# EAGLE design Memory Display V2 (EAGLE 7.7.0)
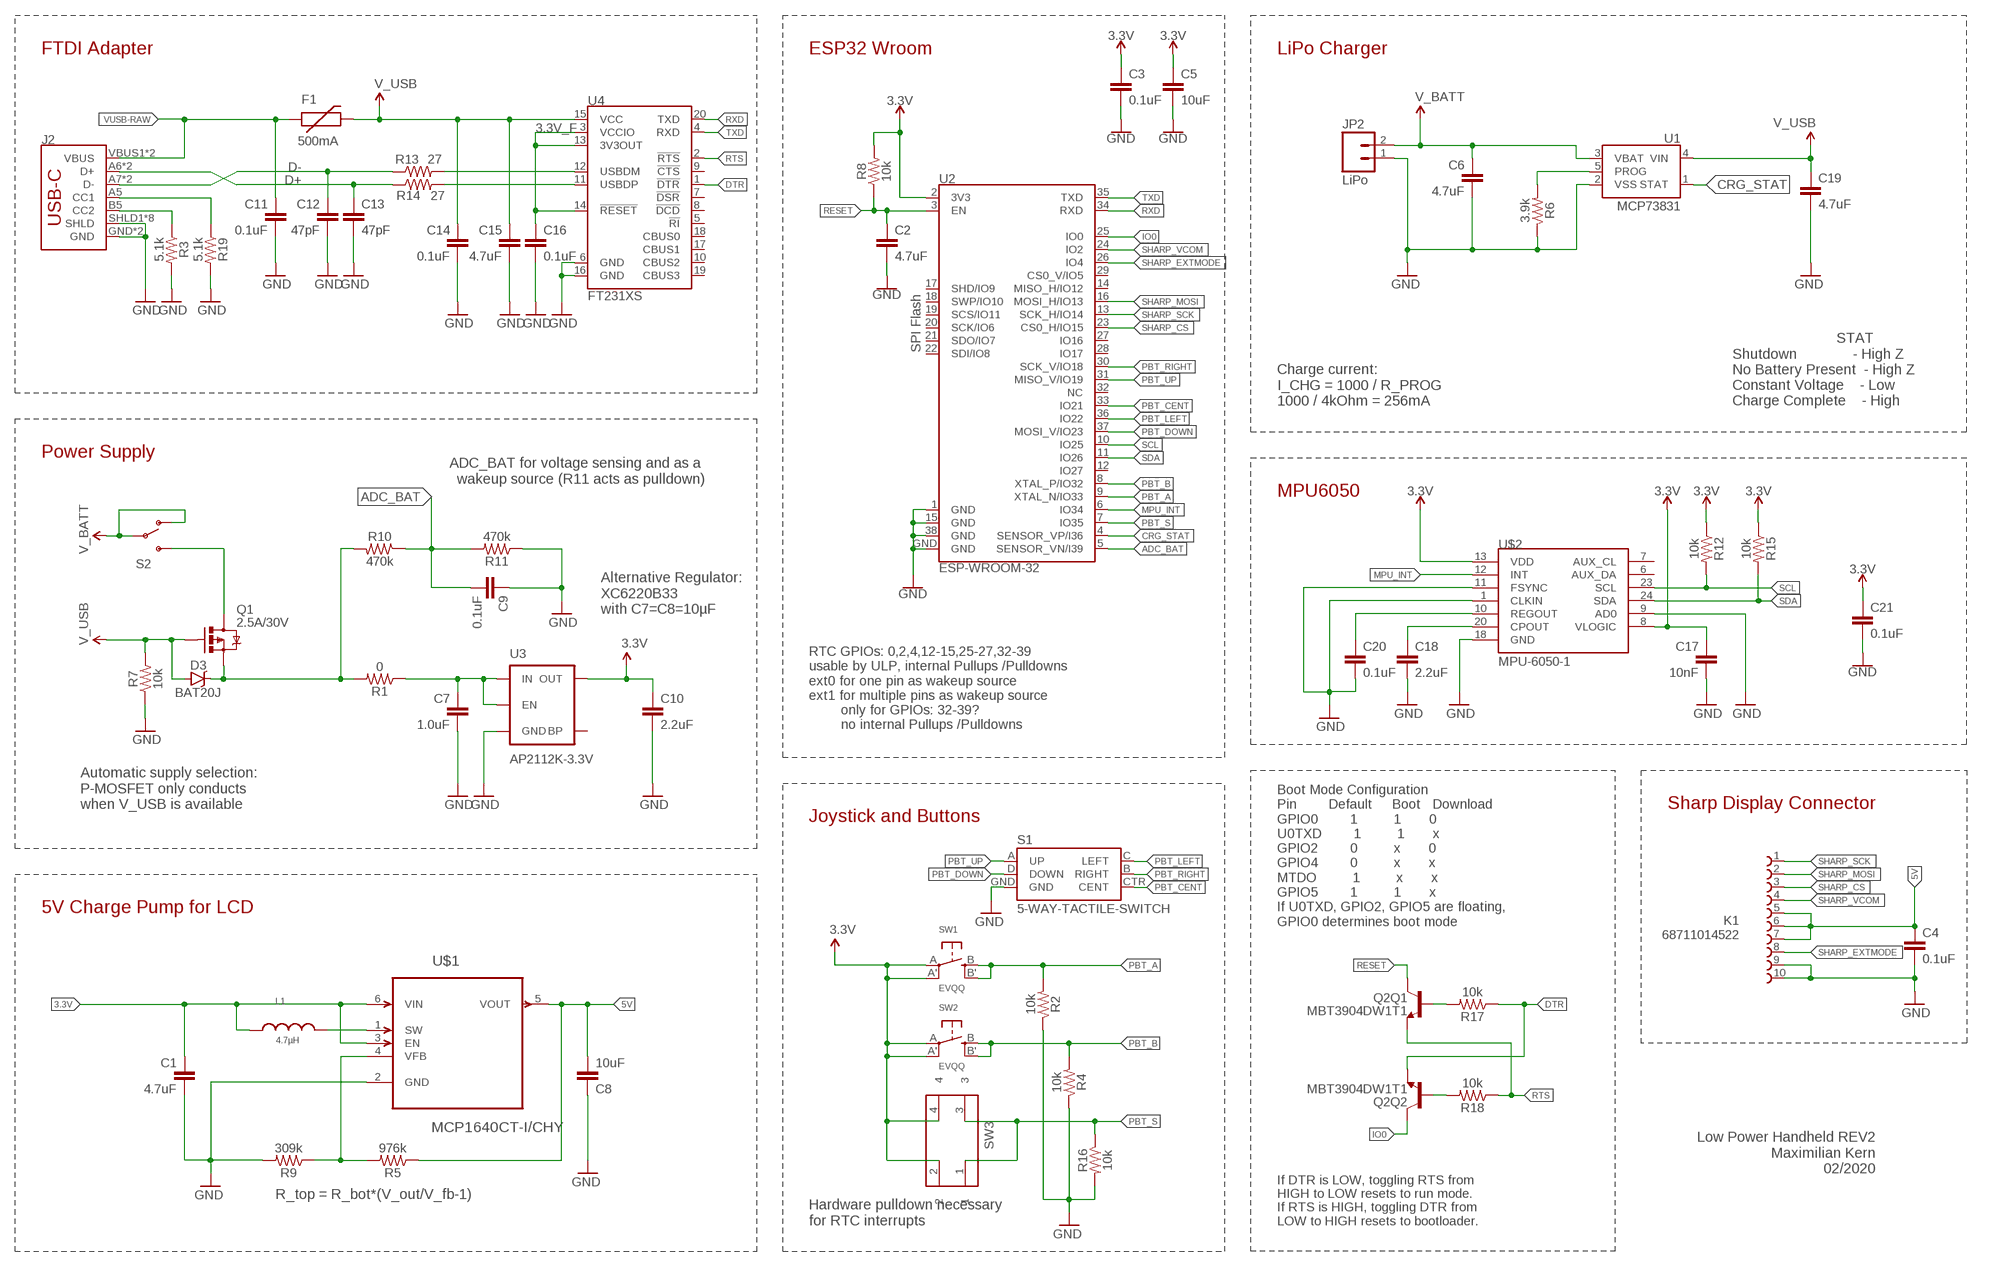
[diagram p0: schematic, sheet 1]

## Parts
C1  4.7uF  47PF-0603-50V-5%  [0603]
C2  4.7uF  0.1UF-0603-25V-(+80/-20%)  [0603]
C3  0.1uF  0.1UF-0603-25V-(+80/-20%)  [0603]
C4  0.1uF  0.1UF-0603-25V-(+80/-20%)  [0603]
C5  10uF  10UF-0603-6.3V-20%  [0603]
C6  4.7uF  4.7UF0603  [0603]
C7  1.0uF  1.0UF-0805-25V-(+80/-20%)  [0805]
C8  10uF  47PF-0603-50V-5%  [0603]
C9  0.1uF  0.1UF-0603-25V-(+80/-20%)  [0603]
C10  2.2uF  1.0UF-0805-25V-(+80/-20%)  [0805]
C11  0.1uF  0.1UF-0603-25V-(+80/-20%)  [0603]
C12  47pF  47PF-0603-50V-5%  [0603]
C13  47pF  47PF-0603-50V-5%  [0603]
C14  0.1uF  0.1UF-0603-25V-(+80/-20%)  [0603]
C15  4.7uF  4.7UF-6.3V-10%(0603)0603  [0603-CAP]
C16  0.1uF  0.1UF-0603-25V-(+80/-20%)  [0603]
C17  10nF  47PF-0603-50V-5%  [0603]
C18  2.2uF  1.0UF-0805-25V-(+80/-20%)  [0805]
C19  4.7uF  4.7UF0603  [0603]
C20  0.1uF  0.1UF-0603-25V-(+80/-20%)  [0603]
C21  0.1uF  0.1UF-0603-25V-(+80/-20%)  [0603]
D3  BAT20J  DIODE-SCHOTTKY-BAT20J  [SOD-323]
F1  500mA  PTCSMD  [PTC-1206]
J2  USB_C16PIN  [USB-C-16P]
JP2  LiPo  M02JST-PTH-2  [JST-2-PTH]
K1  68711014522  [68711014522]
L1  4.7µH  WE-TPC_2813_744029004  [WE-TPC_2811/2813_OLD]
Q1  2.5A/30V  MOSFET-PCHANNELDMG2307L  [SOT23-3]
Q2  MBT3904DW1T1  [SC70-6]
R1  0  10KOHM-0603-1/10W-1%  [0603]
R2  10k  10KOHM-0603-1/10W-1%  [0603]
R3  5.1k  10KOHM-0603-1/10W-1%  [0603]
R4  10k  10KOHM-0603-1/10W-1%  [0603]
R5  976k  10KOHM-0603-1/10W-1%  [0603]
R6  3.9k  2.0KOHM1/10W5%(0603)  [0603]
R7  10k  10KOHM-0603-1/10W-1%  [0603]
R8  10k  10KOHM-0603-1/10W-1%  [0603]
R9  309k  10KOHM-0603-1/10W-1%  [0603]
R10  470k  10KOHM-0603-1/10W-1%  [0603]
R11  470k  10KOHM-0603-1/10W-1%  [0603]
R12  10k  10KOHM-0603-1/10W-1%  [0603]
R13  27  27OHM1/10W1%(0603)0603-RES  [0603]
R14  27  27OHM1/10W1%(0603)0603-RES  [0603]
R15  10k  10KOHM-0603-1/10W-1%  [0603]
R16  10k  10KOHM-0603-1/10W-1%  [0603]
R17  10k  10KOHM-0603-1/10W-1%  [0603]
R18  10k  10KOHM-0603-1/10W-1%  [0603]
R19  5.1k  10KOHM-0603-1/10W-1%  [0603]
S1  5-WAY-TACTILE-SWITCH  JOYSTICK_MINI  [JOYSTICK_MINI]
S2  SWITCH-SPDT-SMD-A  [SWITCH-SPST-SMD-A]
SW1  EVQQ  SWITCH_TACT_SMT_EVQQ2_SMALL  [EVQ-Q2_SMALLER]
SW2  EVQQ  SWITCH_TACT_SMT_EVQQ2_SMALL  [EVQ-Q2_SMALLER]
SW3  434331045822  [434331045822]
U1  MCP73831  [SOT23-5]
U2  ESP-WROOM-32  [ESP-WROOM-32]
U3  AP2112K-3.3V  V_REG_LDOSMD  [SOT23-5]
U4  FT231XS  [SSOP20_L]
U$1  MCP1640CT-I/CHY  [SOT95P270X145-6N]
U$2  MPU-6050-1  [QFN-24-4MM2]

## Nets
3.3V: C1.1 C3.1 C5.1 C10.1 C17.1 C21.1 L1.1 R8.2 R12.1 R15.1 SW1.A'(P1) SW1.A(P) SW2.A'(P1) SW2.A(P) SW3.2 SW3.4 U2.2(3V3) U3.5(OUT) U$1.3(EN) U$1.6(VIN) U$2.8(VLOGIC) U$2.13(VDD)
3.3V_F: C16.1 U4.3(VCCIO) U4.13(3V3OUT) U4.14(!RESET)
5V: C4.1 C8.2 K1.5 K1.6 K1.7 R5.1 U$1.5(VOUT)
ADC_BAT: C9.2 R10.1 R11.2 U2.5(SENSOR_VN/I39)
B_VFB: R5.2 R9.1 U$1.4(VFB)
CRG_STAT: U1.1(STAT) U2.4(SENSOR_VP/I36)
D+: C13.1 J2.A6(D+) J2.B6(D+) R14.1
D-: C12.1 J2.A7(D-) J2.B7(D-) R13.1
DTR: Q2.1(Q2:E) R17.1 U4.1(!DTR)
GND: C1.2 C2.2 C3.2 C4.2 C5.2 C6.2 C7.2 C8.1 C9.1 C10.2 C11.2 C12.2 C13.2 C14.2 C15.2 C16.2 C17.2 C18.2 C19.2 C20.2 C21.2 J2.GND J2.GND2(GND) J2.SHLD1(SHLD) J2.SHLD2(SHLD) J2.SHLD3(SHLD) J2.SHLD4(SHLD) J2.SHLD5(SHLD) J2.SHLD6(SHLD) J2.SHLD7(SHLD) J2.SHLD8(SHLD) JP2.1 K1.9 K1.10 R2.1 R3.2 R4.1 R6.1 R7.1 R9.2 R11.1 R16.2 R19.2 S1.GND U1.2(VSS) U2.1(GND) U2.15(GND) U2.38(GND) U2.GND U3.2(GND) U4.6(GND) U4.16(GND) U$1.2(GND) U$2.1(CLKIN) U$2.9(AD0) U$2.11(FSYNC) U$2.18(GND)
IO0: Q2.6(Q2:C) U2.25(IO0)
MPU_INT: U2.6(IO34) U$2.12(INT)
N$2: L1.2 U$1.1(SW)
N$3: C7.1 R1.1 U3.1(IN) U3.3(EN)
N$4: Q1.3(D) S2.3(S)
N$5: D3.C Q1.2(S) R1.2 R10.2
N$7: R13.2 U4.12(USBDM)
N$8: R14.2 U4.11(USBDP)
N$9: J2.A5(CC1) R19.1
N$10: Q2.5(Q1:B) R17.2
N$11: J2.B5(CC2) R3.1
N$12: Q2.2(Q2:B) R18.2
N$16: R6.2 U1.5(PROG)
N$17: C18.1 U$2.20(CPOUT)
N$18: C20.1 U$2.10(REGOUT)
PBT_A: R2.2 SW1.B'(S1) SW1.B(S) U2.9(XTAL_N/IO33)
PBT_B: R4.2 SW2.B'(S1) SW2.B(S) U2.8(XTAL_P/IO32)
PBT_CENT: S1.CTR(CENT) U2.33(IO21)
PBT_DOWN: S1.D(DOWN) U2.37(MOSI_V/IO23)
PBT_LEFT: S1.C(LEFT) U2.36(IO22)
PBT_RIGHT: S1.B(RIGHT) U2.30(SCK_V/IO18)
PBT_S: R16.1 SW3.1 SW3.3 U2.7(IO35)
PBT_UP: S1.A(UP) U2.31(MISO_V/IO19)
RESET: C2.1 Q2.3(Q1:C) R8.1 U2.3(EN)
RTS: Q2.4(Q1:E) R18.1 U4.2(!RTS)
RXD: U2.34(RXD) U4.20(TXD)
SCL: R12.2 U2.10(IO25) U$2.23(SCL)
SDA: R15.2 U2.11(IO26) U$2.24(SDA)
SHARP_CS: K1.3 U2.23(CS0_H/IO15)
SHARP_EXTMODE: K1.8 U2.26(IO4)
SHARP_MOSI: K1.2 U2.16(MOSI_H/IO13)
SHARP_SCK: K1.1 U2.13(SCK_H/IO14)
SHARP_VCOM: K1.4 U2.24(IO2)
TXD: U2.35(TXD) U4.4(RXD)
V_BATT: C6.1 JP2.2 S2.1(O) S2.2(P) U1.3(VBAT)
V_USB: C14.1 C15.1 C19.1 D3.A F1.2 Q1.1(G) R7.2 U1.4(VIN) U4.15(VCC)
VUSB-RAW: C11.1 F1.1 J2.VBUS1(VBUS) J2.VBUS2(VBUS)
Unconnected: U2.12(IO27) U2.14(MISO_H/IO12) U2.17(SHD/IO9) U2.18(SWP/IO10) U2.19(SCS/IO11) U2.20(SCK/IO6) U2.21(SDO/IO7) U2.22(SDI/IO8) U2.27(IO16) U2.28(IO17) U2.29(CS0_V/IO5) U2.32(NC) U3.4(BP) U4.5(!RI) U4.7(!DSR) U4.8(!DCD) U4.9(!CTS) U4.10(CBUS2) U4.17(CBUS1) U4.18(CBUS0) U4.19(CBUS3) U$2.6(AUX_DA) U$2.7(AUX_CL)

## Notes on the sheet
- FTDI Adapter | ESP32 Wroom | LiPo Charger
- SPI Flash
- Charge current:
  I_CHG = 1000 / R_PROG
  1000 / 4kOhm = 256mA
- STAT
  Shutdown              - High Z 
  No Battery Present  - High Z 
  Constant Voltage    - Low
  Charge Complete    - High
- Power Supply
- ADC_BAT for voltage sensing and as a 
  wakeup source (R11 acts as pulldown)
- MPU6050
- Alternative Regulator: 
  XC6220B33
  with C7=C8=10µF
- RTC GPIOs: 0,2,4,12-15,25-27,32-39
  usable by ULP, internal Pullups /Pulldowns
  ext0 for one pin as wakeup source
  ext1 for multiple pins as wakeup source
          only for GPIOs: 32-39?
          no internal Pullups /Pulldowns
- Sharp Display Connector
- Automatic supply selection:
  P-MOSFET only conducts
  when V_USB is available
- Joystick and Buttons
- 5V Charge Pump for LCD
- Boot Mode Configuration
  Pin        Default     Boot   Download
  GPIO0        1         1       0
  U0TXD        1         1       x
  GPIO2        0         x       0
  GPIO4        0         x       x
  MTDO         1         x       x
  GPIO5        1         1       x
  If U0TXD, GPIO2, GPIO5 are floating, 
  GPIO0 determines boot mode
- Low Power Handheld REV2
  Maximilian Kern
  02/2020
- R_top = R_bot*(V_out/V_fb-1)
- Hardware pulldown necessary
  for RTC interrupts
- If DTR is LOW, toggling RTS from 
  HIGH to LOW resets to run mode.
  If RTS is HIGH, toggling DTR from 
  LOW to HIGH resets to bootloader.

## Library data of the parts
C1 C8 C17 = SparkFun-Capacitors:47PF: 47pF ceramic capacitors A capacitor is a passive two-terminal electrical component used to store electrical energy temporarily in an electric field.; PROD_ID: CAP-08913; VALUE: 47pF
C2 = SparkFun-Capacitors:0.1UF: 0.1µF ceramic capacitors A capacitor is a passive two-terminal electrical component used to store electrical energy temporarily in an electric field.; PROD_ID: CAP-00810; VALUE: 0.1uF
C3 C4 C9 C11 C14 C16 C20 C21 = SparkFun-Capacitors:0.1UF: 0.1µF ceramic capacitors A capacitor is a passive two-terminal electrical component used to store electrical energy temporarily in an electric field.; PROD_ID: CAP-00810
C5 = SparkFun-Capacitors:10UF: 10.0µF ceramic capacitors A capacitor is a passive two-terminal electrical component used to store electrical energy temporarily in an electric field.; PROD_ID: CAP-11015
C6 C19 = SparkFun-Capacitors:4.7UF: 4.7µF ceramic capacitors A capacitor is a passive two-terminal electrical component used to store electrical energy temporarily in an electric field.; PROD_ID: CAP-08280
C7 = SparkFun-Capacitors:1.0UF: 1µF ceramic capacitors A capacitor is a passive two-terminal electrical component used to store electrical energy temporarily in an electric field.; PROD_ID: CAP-11625
C10 C18 = SparkFun-Capacitors:1.0UF: 1µF ceramic capacitors A capacitor is a passive two-terminal electrical component used to store electrical energy temporarily in an electric field.; PROD_ID: CAP-11625; VALUE: 1.0uF
C12 C13 = SparkFun-Capacitors:47PF: 47pF ceramic capacitors A capacitor is a passive two-terminal electrical component used to store electrical energy temporarily in an electric field.; PROD_ID: CAP-08913
C15 = SparkFun-Capacitors:4.7UF-6.3V-10%(0603): CAP-08280; PROD_ID: CAP-08280
D3 = SparkFun-DiscreteSemi:DIODE-SCHOTTKY: Schottky diodes in SFE's production catalog BAT20J 1A 23V 0.62Vf RB751 120mA 40V 0.37Vf PMEG4005EJ 0.5A 40V 0.42Vf MBRA140 1A 40V 0.5Vf B340A 3A 40V SMA; PROD_ID: DIO-11623
F1 = SparkFun-PowerIC:PTC: Resettable Fuse PTC Resettable Fuse. Spark Fun Electronics SKU : COM-08357; PROD_ID: RES-11150
J2 = SparkFun-Connectors:USB_C: USB Type C 16Pin Connector Super Speed pins not available on the 16-pin purely SMD connector so this part is best for USB 2.0 implementations. D1 and D2 are tied together enabling D+/- no matter which way the cable is plugged into the connector. The two channel configuration pins (CC1/2) are exposed. These are normally connected to ground via 5.1k resistors but can be reconfigured for high current/high power applications.; PROD_ID: CONN-14122
JP2 = SparkFun-Connectors:M02: Standard 2-pin 0.1" header. Use with - straight break away headers ( PRT-00116) - right angle break away headers (PRT-00553) - swiss pins (PRT-00743) - machine pins (PRT-00117) - female headers (PRT-00115) Molex polarized connector foot print use with: PRT-08233 with associated crimp pins and housings. 2.54_SCREWTERM for use with PRT-10571. 3.5mm Screw Terminal footprints for PRT-08084 5mm Screw Terminal footprints for use with PRT-08432; PROD_ID: CONN-09863; SKU: PRT-09914
K1 = Eagle_FPC_CONNECTOR_AND_FFC_CAB_rev15c:68711014522: WR-FPC 0.5mm SMT ZIF Horizontal Bottom Contact, 10 Pins=>Code : Con_FPC_ZIF_0.50_68711014522 <http://katalog.we-online.de/media/images/eican/Con_FPC_ZIF_0.50_6871xx14522_pf2.jpg> Details see: http://katalog.we-online.de/en/em/687_1xx_145_22 Created 2014-07-09, Karrer Zheng 2014 (C) Würth Elektronik
L1 = EMCComponents (rev19e):WE-TPC_2813: SMD Shielded Tiny Power Inductor Characteristics Extremely flat power inductor High current capability Magnetically shielded which results in a low leakage field Operating temperature: –40 °C to +125 °C Applications Portable power like PDA, digital camera, PCMCIA cards and displays DC/DC converter Embedded PC Mobile data gathering, telemetric <http://katalog.we-online.de/media/images/v2/WE-TPC_Gruppe_2.jpg> Details see: http://katalog.we-online.de/en/pbs/WE-TPC? Updated by Dan Xu 2014-07-11 2014 (C) Wurth Elektronik; WE-NUMBER: 744029004/4,7uH
Q1 = SparkFun-DiscreteSemi:MOSFET-PCHANNEL: Generic PMOSFET IRLML2244 - TRANS-11153 (SOT-23 -20V -4.3A) (1.Gate 2.Source 3.Drain) FQP27P06 - COM-10349 <http://www.sparkfun.com/products/10349> (TO-220 -60V -27A) (1.Gate 2.Source 3.Drain); PROD_ID: TRANS-11308
Q2 = esp32-thing-temp:MBT3904DW1T1: MBT3904DW1 Dual NPN Transistors The MBT3904W1 puts two general purpose 3904 NPN transistors in a single package. Datasheet <http://www.onsemi.com/pub_link/Collateral/MBT3904DW1T1-D.PDF>; PROD_ID: TRANS-13337
R1 R3 R5 R9-R11 R19 = SparkFun-Resistors:10KOHM: 10kΩ resistor A resistor is a passive two-terminal electrical component that implements electrical resistance as a circuit element. Resistors act to reduce current flow, and, at the same time, act to lower voltage levels within circuits. - Wikipedia; PROD_ID: RES-00824; VALUE: 10k
R2 R4 R7 R8 R12 R15-R18 = SparkFun-Resistors:10KOHM: 10kΩ resistor A resistor is a passive two-terminal electrical component that implements electrical resistance as a circuit element. Resistors act to reduce current flow, and, at the same time, act to lower voltage levels within circuits. - Wikipedia; PROD_ID: RES-00824
R6 = SparkFun-Resistors:2.0KOHM1/10W5%(0603): RES-08296; PROD_ID: RES-08296; VALUE: 2.0k
R13 R14 = SparkFun-Resistors:27OHM1/10W1%(0603): RES-09334; PROD_ID: RES-09334
S1 = SparkFun-Electromechanical:JOYSTICK_MINI: Small 5-way tactile joystick, COM-10063 4UCON SF303GJ26
S2 = SparkFun-Electromechanical:SWITCH-SPDT: SPDT Switch Simple slide switch, Spark Fun Electronics SKU : COM-00102 DPDT SMT slide switch, AYZ0202, SWCH-08179; PROD_ID: SWCH-10651
SW1 SW2 = microbuilder:SWITCH_TACT_SMT: SMT Tact Switches 6x6mm - Digikey: P12940SCT-ND KMR2 (4.6x2.8mm) - Digikey: 401-1426-1-ND EVQ-PQHB55 - Light Touch, 160GF (4.5x4.5mm) - Digikey: P8090SCT-ND KMT0 - KMT021 NGJ LHS (etc.) IP68/Waterproof - Digikey: CKN10289CT-ND
SW3 = Eagle_TACT_SWITCHES_rev16d:434331045822: 3.5x4.7 mm SMD side push WS-TASU <http://katalog.we-online.de/media/images/v2/Family_WS_TUS_Normal_SMD_Side-Push_4343x10458xx_pf2.jpg> Details see: http://katalog.we-online.de/en/em/TASU_3_5X4_7_SMD_J-BEND_SIDE_PUSH <http://katalog.we-online.de/en/em/TASU_3_5X4_7_SMD_SIDE_PUSH> 2015 (C) Wurth Elektronik
U1 = SparkFun-PowerIC:MCP73831: Miniature single cell, fully integrated Li-Ion, Li-polymer charge management controller http://ww1.microchip.com/downloads/en/DeviceDoc/20001984g.pdf IC-09995; PROD_ID: IC-09995
U2 = SparkFun-RF:ESP-WROOM-32; PROD_ID: IC-13849
U3 = SparkFun-PowerIC:V_REG_LDO: Voltage Regulator LDO Standard 150mA LDO voltage regulator in SOT-23 layout. Micrel part MIC5205. BP (by-pass) pin is used to lower output noise with 470pF cap.; PROD_ID: VREG-12457
U4 = SparkFun-DigitalIC:FT231X: FTDI FT231X Full Speed USB to Full-handshake UART This USB2.0 Full Speed IC offers a compact bridge to full handshake UART interfaces. The device is a UART, capable of operating up to 3MBaud, with low power consumption (8mA). The FT231X includes the complete FT-X series feature set and enables USB to be added into a system design quickly and easily over a UART interface.; PROD_ID: IC-11524
U$1 = Microchip_By_element14_Batch_1:MCP1640CT-I/CHY: Synchronous Boost Regulator; MPN: MCP1640CT-I/CHY; OC_FARNELL: 1800208; OC_NEWARK: 73R3626; PACKAGE: SOT-6; SUPPLIER: Microchip
U$2 = MPU-6050 hand solder:MPU-6050

## Board
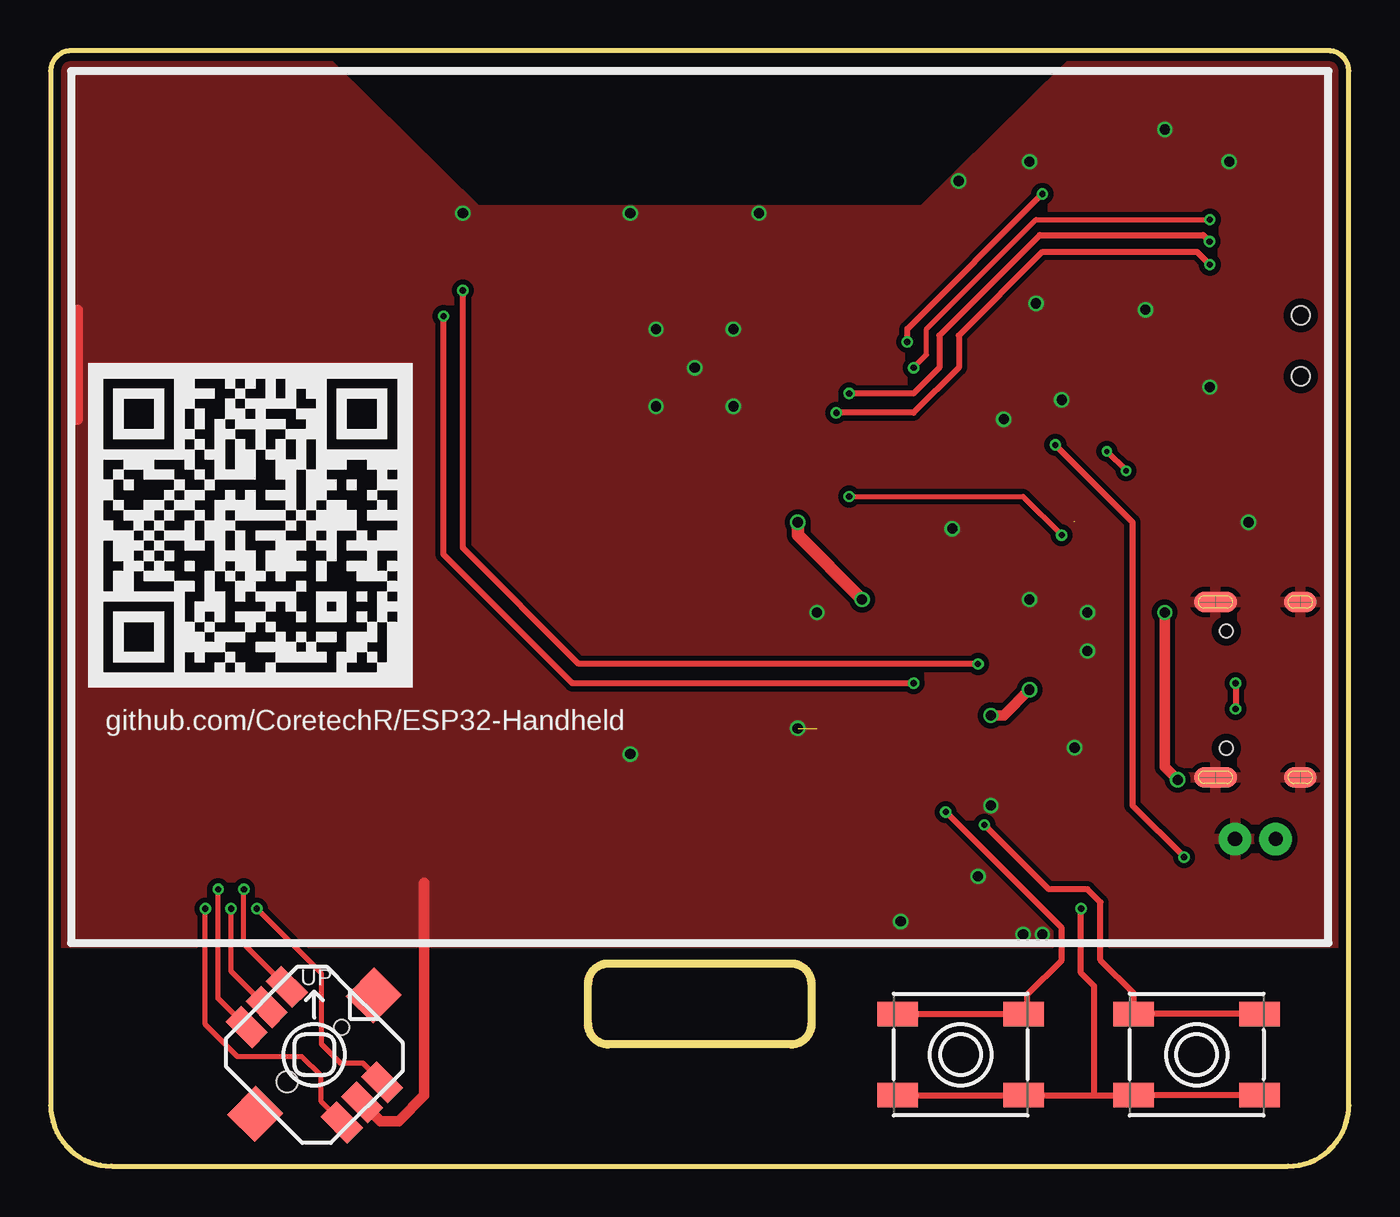
[diagram p1: board, top side]
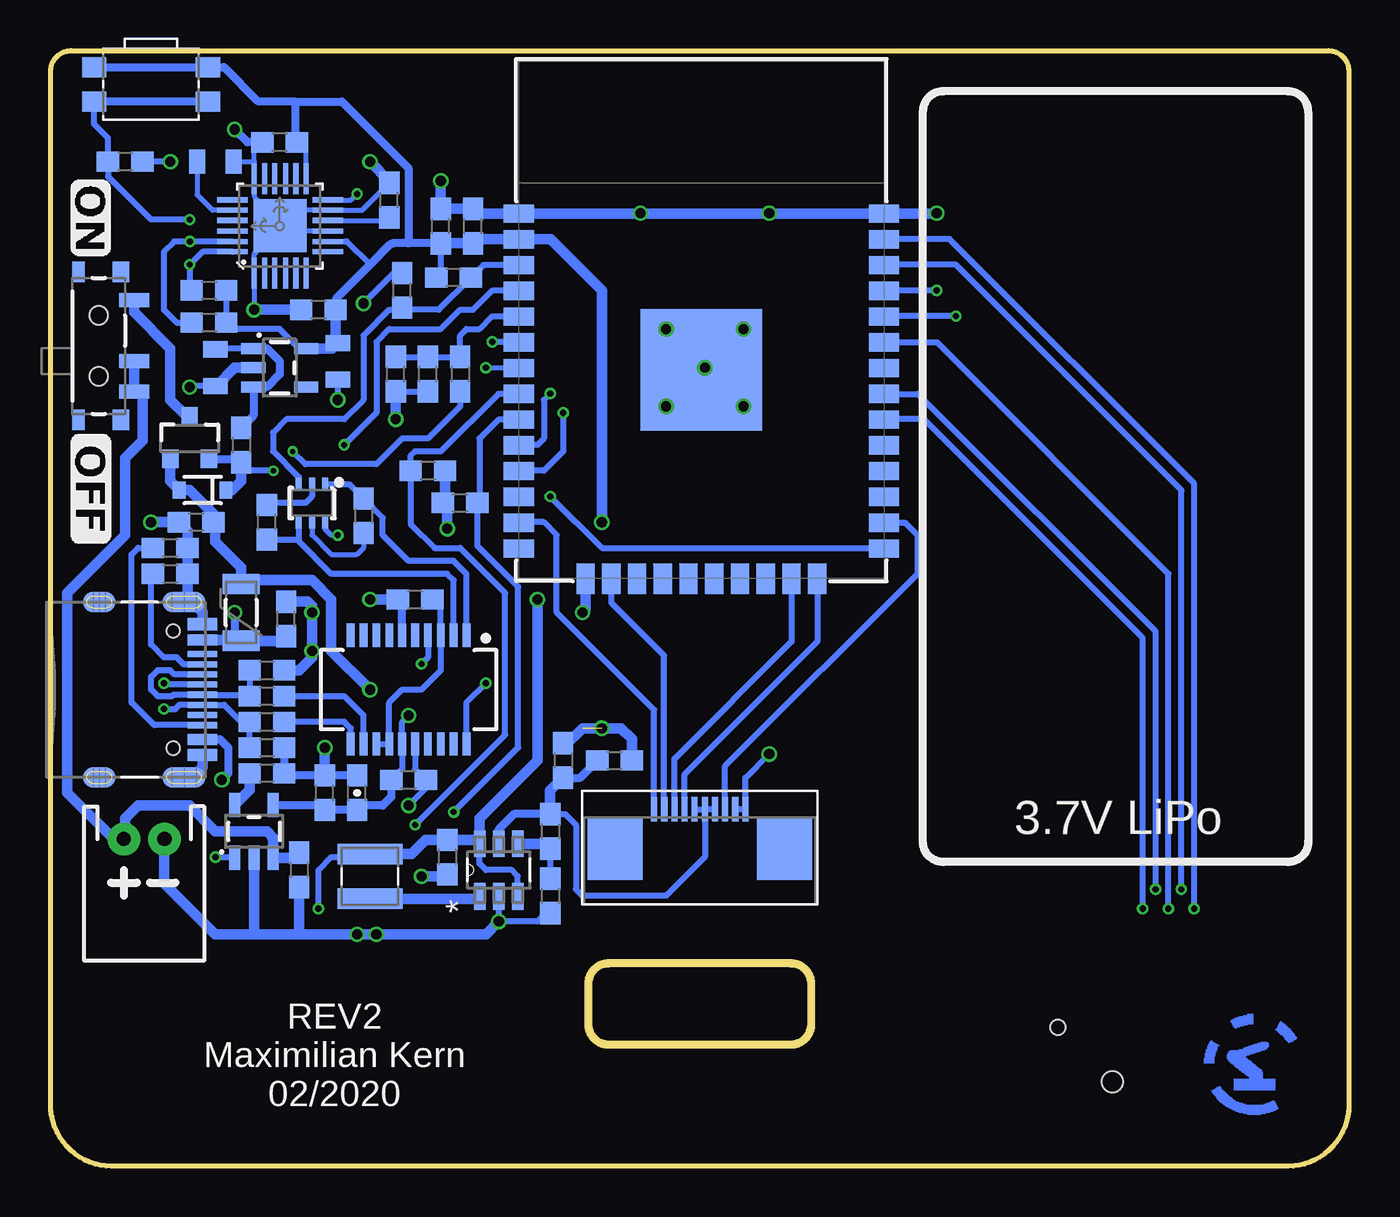
[diagram p2: board, bottom side, seen from below]

Size 64 x 55 mm. Coordinates in mm from the lower left corner, seen from the top.
Outline: 63,55 1,55 arc90 0,54 0,3 arc90 3,0 61,0 arc90 64,3 64,54 arc90 63,55
Copper layers (1*16): Top 0.035559375mm / dielectric 1.6mm / Bottom 0.035559375mm
Design rules "oshpark-2layer *": minimum track width 6mil, minimum drill 10mil, track to track 6mil, track to pad 6mil, pad to pad 6mil, via to via 6mil, smd to smd 6mil, copper to edge 15mil, drill to drill 6mil, minimum pad ring 5mil, minimum via ring 5mil, stop-mask expansion 2.5mil, vias tented up to drill 43mil, thermal gap 10mil
bKeepout: area 2,15 to 21,53
Milling: 8 lines

### Footprints (pad centres in the part's own frame; a part is rotated, then mirrored left to right if it is on the bottom)
0603 = smd 1.1 x 1: 1 -0.85,0; 2 0.85,0
0805 = smd 0.8 x 1.2: 1 -0.9,0; 2 0.9,0
0603-CAP = smd 1.1 x 1: 1 -0.85,0; 2 0.85,0
SOD-323 = smd 0.63 x 0.83: A 1.15,0; C -1.15,0
PTC-1206 = smd 1 x 1.8: 1 -1.4,0; 2 1.4,0
USB-C-16P = smd 0.3 x 1.45: A5 -1.25,0; A6 -0.25,0; A7 0.25,0; A8 1.25,0; B5 1.75,0; B6 0.75,0; B7 -0.75,0; B8 -1.75,0 | smd 0.6 x 1.45: GND -3.225,0; GND2 3.225,0 | smd 1 x 2.1: SHLD1 -4.32,-0.915; SHLD2 4.32,-0.915 | smd 1 x 2.1 bottom: SHLD3 -4.32,-0.915; SHLD4 4.32,-0.915 | smd 1 x 1.6: SHLD5 -4.32,-5.095; SHLD8 4.32,-5.095 | smd 1 x 1.6 bottom: SHLD6 -4.32,-5.095; SHLD7 4.32,-5.095 | smd 0.55 x 1.45: VBUS1 -2.45,0; VBUS2 2.45,0 | hole 0.65: -2.89,-1.445; 2.89,-1.445
JST-2-PTH = drill 0.7 pad 1.6: 1 -1,0; 2 1,0
68711014522 = smd 0.3 x 1.2: 1 -2.25,0.6; 2 -1.75,0.6; 3 -1.25,0.6; 4 -0.75,0.6; 5 -0.25,0.6; 6 0.25,0.6; 7 0.75,0.6; 8 1.25,0.6; 9 1.75,0.6; 10 2.25,0.6 | smd 2.7 x 3: Z1 -4.18,-1.38; Z2 4.18,-1.38
WE-TPC_2811/2813_OLD = smd 1 x 3.2: 1 -1.1,0; 2 1.1,0
SOT23-3 = smd 0.8 x 0.9: 1 -0.95,-1; 2 0.95,-1; 3 0,1.1
SC70-6 = smd 0.3 x 0.66: 1 -0.65,-0.92; 2 0,-0.92; 3 0.65,-0.92; 4 0.65,0.92; 5 0,0.92; 6 -0.65,0.92
JOYSTICK_MINI = smd 1.85 x 1.1: A -3.325,1.4; B 3.325,1.4; C -3.325,-1.4; CTR -3.325,0; D 3.325,-1.4; GND 3.325,0 | smd 1.9 x 2: NC 0,4.13; NC@0 0,-4.13 | hole 0.75: 0,1.9 | hole 1.05: 0,-1.9
SWITCH-SPST-SMD-A = smd 0.7 x 1.5: 1 -2.25,-1.75; 2 -0.75,-1.75; 3 2.25,-1.75 | smd 1 x 0.6: GND1 -3.65,1; GND3 3.65,1 | smd 1 x 0.8: GND2 -3.65,-1.1; GND4 3.65,-1.1 | hole 0.9: -1.5,0; 1.5,0
EVQ-Q2_SMALLER = smd 2 x 1.2: A -3.1,-2; A' 3.1,-2; B -3.1,2; B' 3.1,2
434331045822 = smd 1.2 x 1: 1 2.8,0.85; 2 2.8,-0.85; 3 -2.8,0.85; 4 -2.8,-0.85
SOT23-5 = smd 0.55 x 1.2: 1 -0.95,-1.3; 2 0,-1.3; 3 0.95,-1.3; 4 0.95,1.3; 5 -0.95,1.3
ESP-WROOM-32 = smd 0.9 x 1.5: 1 7.7,9; 2 6.43,9; 3 5.16,9; 4 3.89,9; 5 2.62,9; 6 1.35,9; 7 0.08,9; 8 -1.19,9; 9 -2.46,9; 10 -3.73,9; 11 -5,9; 12 -6.27,9; 13 -7.54,9; 14 -8.81,9; 25 -8.81,-9; 26 -7.54,-9; 27 -6.27,-9; 28 -5,-9; 29 -3.73,-9; 30 -2.46,-9; 31 -1.19,-9; 32 0.08,-9; 33 1.35,-9; 34 2.62,-9; 35 3.89,-9; 36 5.16,-9; 37 6.43,-9; 38 7.7,-9 | smd 1.5 x 0.9: 15 -10.3,5.715; 16 -10.3,4.445; 17 -10.3,3.175; 18 -10.3,1.905; 19 -10.3,0.635; 20 -10.3,-0.635; 21 -10.3,-1.905; 22 -10.3,-3.175; 23 -10.3,-4.445; 24 -10.3,-5.715 | smd 6 x 6: GND 0,0
SSOP20_L = smd 0.381 x 1.143: 1 -2.857,-2.68; 2 -2.223,-2.68; 3 -1.587,-2.68; 4 -0.953,-2.68; 5 -0.318,-2.68; 6 0.318,-2.68; 7 0.953,-2.68; 8 1.587,-2.68; 9 2.223,-2.68; 10 2.857,-2.68; 11 2.857,2.68; 12 2.223,2.68; 13 1.587,2.68; 14 0.953,2.68; 15 0.318,2.68; 16 -0.318,2.68; 17 -0.953,2.68; 18 -1.587,2.68; 19 -2.223,2.68; 20 -2.857,2.68
SOT95P270X145-6N = smd 1.321 x 0.559: 1 -1.295,0.94; 2 -1.295,0; 3 -1.295,-0.94; 4 1.295,-0.94; 5 1.295,0; 6 1.295,0.94
QFN-24-4MM2 = smd 1.516 x 0.254: 1 -2.316,1.257; 2 -2.316,0.75; 3 -2.316,0.247; 4 -2.316,-0.287; 5 -2.316,-0.792; 6 -2.316,-1.297; 13 2.336,-1.297; 14 2.336,-0.792; 15 2.336,-0.287; 16 2.336,0.247; 17 2.336,0.75; 18 2.336,1.257 | smd 0.254 x 1.516: 7 -1.267,-2.372; 8 -0.762,-2.372; 9 -0.258,-2.372; 10 0.278,-2.372; 11 0.78,-2.372; 12 1.287,-2.372; 19 1.287,2.332; 20 0.78,2.332; 21 0.278,2.332; 22 -0.258,2.332; 23 -0.762,2.332; 24 -1.267,2.332 | smd 2.616 x 2.616: P$1 0.02,-0.01

### Placement (x,y rotation side)
C1  44.45,15.24 270 bottom
C2  46.67,43.18 90 bottom
C3  44.77,46.35 90 bottom
C4  36.2,20 0 bottom
C5  43.18,46.35 90 bottom
C6  51.75,14.61 270 bottom
C7  55.88,39.37 270 bottom
C8  38.73,20 270 bottom
C9  46.99,39.05 90 bottom
C10  49.85,39.69 270 bottom
C11  52.39,26.99 90 bottom
C12  53.34,24.45 0 bottom
C13  53.34,20.64 0 bottom
C14  46.35,19.05 0 bottom
C15  48.9,18.41 90 bottom
C16  46.04,27.94 180 bottom
C17  50.8,42.23 180 bottom
C18  55.88,49.53 0 bottom
C19  50.48,18.41 90 bottom
C20  47.31,47.62 90 bottom
C21  52.7,50.48 180 bottom
D3  56.52,33.34 180 bottom
F1  54.61,27.3 90 bottom
J2  56.52,23.5 270 bottom
JP2  59.4,16.14 180 bottom
K1  32,17 0 bottom
L1  48.26,14.29 270 bottom
Q1  57.15,35.88 0 bottom
Q2  51.12,32.7 180 bottom
R1  54.61,35.56 270 bottom
R2  43.81,32.7 0 bottom
R3  58.1,30.48 0 bottom
R4  45.4,34.29 180 bottom
R5  39.37,16.51 270 bottom
R6  53.34,19.37 180 bottom
R7  56.83,31.75 0 bottom
R8  44.13,43.81 180 bottom
R9  39.37,13.34 270 bottom
R10  43.81,39.05 270 bottom
R11  45.4,39.05 90 bottom
R12  56.2,41.59 180 bottom
R13  53.34,23.18 0 bottom
R14  53.34,21.91 0 bottom
R15  56.2,43.18 180 bottom
R16  60.33,49.53 0 bottom
R17  48.58,32.07 270 bottom
R18  53.34,31.75 90 bottom
R19  58.1,29.21 0 bottom
S1  13,5.5 315 top
S2  61.63,40.45 90 bottom
SW1  44.87,5.5 0 top
SW2  56.5,5.5 0 top
SW3  59.05,53.34 180 bottom
U1  53.98,16.51 0 bottom
U2  31.92,39.27 90 bottom
U3  52.7,39.37 270 bottom
U4  46.35,23.5 180 bottom
U$1  41.91,14.61 90 bottom
U$2  52.7,46.35 90 bottom

### Tracks (layer width: path | path; a pad name or v marks a point on that pad's centre or on a via)
3.3V  (via drill 0.3, 0.5)
  Top 0.305: SW1.A SW1.A' 51.44,3.5 | SW2.A' SW2.A 51.44,3.5 | v50.8,12.7 50.8,9.53 51.44,8.89 51.44,3.5
  Top 0.61: v36.83,31.75 36.83,31.11 v40.01,27.94
  Bottom 0.254: U$2.8 49.51,45.59 | U$2.13 51.41,50.04 C21.1
  Bottom 0.305: 49.51,45.59 49.4,45.59 48.26,44.45 | U$1.3 40.97,14.3 41.27,14.61 42.55,14.61 42.86,14.92 42.86,15.89 U$1.6 | R15.1 R12.1 | v50.8,12.7 50.8,14.61 50.16,15.24 48.41,15.24 L1.1 | 55.13,41.37 R12.1 | C3.1 44.77,44.03 R8.2 | U3.5 51.75,40.32 52.7,41.27 55.03,41.27 R12.1
  Bottom 0.406: 46.35,45.51 47.1,45.51 arc-45 47.28,45.43 48.26,44.45 49.88,42.83 arc-45 49.95,42.66 C17.1 | 46.35,45.51 46.35,49.21 49.63,52.49 51.95,52.49 | 51.95,52.49 51.95,50.58 C21.1 | C3.1 46.35,45.51 | 51.95,52.49 53.76,52.49 55.46,54.19 SW3.4 SW3.2
  Bottom 0.508: C3.1 C5.1 42.98,45.7 U2.2 39.35,45.7 36.83,43.18 v36.83,31.75 | v40.01,27.94 40.01,20 42.85,17.16 U$1.6 43.04,16.09 C1.1 45.51,16.09 46.21,15.39 L1.1 | C17.1 49.95,40.69 C10.1 50.12,40.32 U3.5
3.3V_F
  Bottom 0.305: U4.13 U4.14 47.31,22.86 46.67,23.5 45.72,23.5 44.77,24.45 U4.3 44.77,27.52 C16.1
5V
  Bottom 0.305: K1.7 K1.6 | K1.5 K1.6 | K1.6 31.75,15.24 33.66,13.34 37.78,13.34 38.1,13.65 38.1,16.83 38.63,17.36 R5.1
  Bottom 0.406: U$1.5 41.91,16.61 41.16,17.36 R5.1 | C8.2 37.9,19.15 C4.1
  Bottom 0.508: R5.1 39.37,18.52 C8.2
ADC_BAT
  Bottom 0.305: C9.2 R11.2 R10.1 43.81,40.96 43.5,41.27 42.86,41.27 42.23,41.91 40.94,41.91 U2.5
B_VFB
  Bottom 0.305: R5.2 R9.1
  Bottom 0.508: U$1.4 39.61,15.9 R5.2
CRG_STAT  (via drill 0.3)
  Top 0.305: v49.53,35.56 53.34,31.75 53.34,17.78 v55.88,15.24
  Bottom 0.305: U2.4 42.25,43.16 43.18,42.23 43.81,42.23 44.77,41.27 47.31,41.27 47.94,40.64 47.94,37.15 v49.53,35.56 | v55.88,15.24 54.95,15.24 U1.1
D+  (via drill 0.3)
  Top 0.305: v58.42,23.81 v58.42,22.54
  Bottom 0.305: C13.1 R14.1 54.61,21.91 55.45,22.75 J2.B6 57.66,22.75 57.86,22.54 v58.42,22.54 | J2.A6 58.35,23.75 v58.42,23.81
D-
  Bottom 0.305: C12.1 R13.1 54.26,23.25 J2.A7 57.95,23.25 58.02,23.18 58.74,23.18 59.05,23.5 59.05,24.13 58.74,24.45 58.1,24.45 57.9,24.25 J2.B7
DTR
  Bottom 0.305: U4.1 43.5,29.21 44.13,29.84 46.35,29.84 47.62,31.11 47.62,31.96 R17.1 | 48.48,33.02 R17.1 | Q2.1 49.28,33.62 R17.1
GND  (via drill 0.5)  (1 unrouted)
  Top 0.508: S1.GND 16.28,2.22 17.14,2.22 18.41,3.49 18.41,13.97 | 1.32,36.81 1.32,42.2
  Bottom 0.254: U2.GND 31.82,39.37 v31.75,39.37 | 53.96,49.53 U$2.18 53.96,47.81 53.11,46.97 | 53.96,49.53 53.96,50.08 C21.2 | C18.2 53.96,49.53 | U$2.9 52.45,46.1 52.7,46.35 51.92,47.13 U$2.11 48.65,47.13 C20.2 | 53.85,45.09 53.96,44.97 U$2.1 53.96,42.24 v53.98,42.23
  Bottom 0.305: K1.9 K1.10 29.75,19.14 v28.57,20.32 | U4.16 46.04,19.58 C14.2 45.51,18.63 v46.35,17.78 | C9.1 R11.1 | U$1.2 v41.91,12.06 40.01,12.06 39.37,12.7 R9.2 | C2.2 47.09,44.03 v48.58,42.55 | C10.2 v49.85,37.78 | C7.2 57.1,38.47 v57.15,38.42 | v58.1,49.53 R16.2 | C8.1 38.73,20.64
  Bottom 0.406: U4.6 46.67,27.73 C16.2 | C13.2 R6.1 52.39,19.27 C19.2 C15.2 | C21.2 54.29,50.48 v54.93,51.12
  Bottom 0.508: v20.32,46.99 20.34,46.97 U2.38 U2.1 42.95,46.97 C5.2 C3.2 v44.77,48.58 | U2.15 37.63,27.45 v37.78,27.3 | C11.2 51.33,27.84 51.12,27.62 v51.12,25.4 51.12,25.08 51.75,24.45 C12.2 | C16.2 v48.26,27.94 | C7.2 55.83,38.47 54.93,39.37 U3.2 | C9.1 v46.99,36.83 | v45.72,14.29 44.55,14.29 C1.2 | J2.GND2 56.52,19.68 56.83,19.37 57.24,19.37 J2.SHLD4 | J2.GND 56.52,27.3 56.83,27.62 57.24,27.62 J2.SHLD1 57.25,27.99 R19.2 R3.2 57.25,31.32 R7.1 v59.05,31.75 | C19.2 v50.48,20.64 | JP2.1 58.4,13.95 55.88,11.43 53.98,11.43 | 53.98,11.43 51.75,11.43 | 51.75,11.43 v47.94,11.43 42.55,11.43 v41.91,12.06 | 51.75,11.43 C6.2 | C17.2 v53.98,42.23 | C4.2 35.34,21.06 35.88,21.59 37.78,21.59 38.73,20.64 | U1.2 53.98,11.43 | R4.1 44.55,32.81 R2.1 44.45,32.49 v44.45,31.43 | C20.2 47.31,48.58 v48.26,49.53
  other vias: 29.84,41.27 29.84,37.47 33.66,37.47 33.66,41.27 28.57,46.99 34.92,46.99 48.9,11.43 51.12,27.3 36.83,21.59
  pour Top (isolate 0.254): -1,56 12,56 21,47.13 43,47.13 52,56 65,56 65,11 -1,11 -1,23.75 17.75,23.75 17.75,39.5 -1,39.5
  pour Top (isolate 0.254): -1,23.75 2,23.75 2,39.5 -1,39.5
IO0  (via drill 0.3)  (1 unrouted)
  Top 0.254: v39.37,33.02 47.94,33.02 v49.85,31.11
  Bottom 0.254: v49.85,31.11 50.16,31.11 50.48,31.43 50.48,31.77
  Bottom 0.305: U2.25 22.92,30.48 36.83,30.48 v39.37,33.02
MPU_INT  (via drill 0.3)
  Top 0.305: v42.23,40.64 42.23,41.27 v48.9,47.94
  Bottom 0.254: U$2.12 49.2,47.64 v48.9,47.94
  Bottom 0.305: U2.6 42.21,40.62 v42.23,40.64
N$2
  Bottom 0.508: L1.2 42.97,13.19 U$1.1
N$3
  Bottom 0.305: U3.1 55.83,40.32 C7.1
  Bottom 0.406: U3.1 53.34,40.32 52.7,39.69 52.7,39.05 53.34,38.42 U3.3 54.01,37.02 R1.1
N$4
  Bottom 0.508: S2.3 59.88,42.1 58.1,40.32 58.1,37.78 57.3,36.98 Q1.3
N$5  (via drill 0.25)
  Top 0.305: v52.07,35.24 v53.02,34.29
  Bottom 0.305: R10.2 43.81,37.47 45.4,35.88 46.67,35.88 47.94,34.61 51.44,34.61 v52.07,35.24 | v53.02,34.29 54.19,34.29 R1.2
  Bottom 0.406: 54.7,34.8 R1.2 54.78,34.88 Q1.2
  Bottom 0.508: R1.2 54.61,33.77 55.05,33.34 D3.C
N$7
  Bottom 0.305: U4.12 48.58,22.23 49.53,23.18 R13.2
N$8
  Bottom 0.305: U4.11 49.21,21.59 49.53,21.91 R14.2
N$9
  Bottom 0.305: J2.A5 57.45,24.75 57.78,25.08 58.42,25.08 59.05,25.72 59.05,29.11 R19.1
N$10
  Bottom 0.254: Q2.5 51.12,31.11 50.16,30.16 48.9,30.16 48.58,30.48 R17.2
N$11
  Bottom 0.305: J2.B5 58.89,21.75 60.01,22.86 60.01,30.16 59.69,30.48 R3.1
N$12
  Bottom 0.305: Q2.2 51.12,33.02 51.44,32.7 53.24,32.7 R18.2
N$16
  Bottom 0.508: R6.2 54.19,18.55 U1.5
N$17
  Bottom 0.254: U$2.20 56.02,47.13 56.78,47.89 C18.1
N$18
  Bottom 0.254: U$2.10 47.45,46.63 C20.1
PBT_A  (via drill 0.3)
  Top 0.305: SW1.B SW1.B' 47.94,7.52 48.16,7.52 48.16,8.47 49.85,10.16 49.85,11.75 v44.13,17.46
  Bottom 0.305: U2.9 41.93,36.81 42.86,35.88 42.86,32.8 R2.2 42.97,30.58 40.96,28.57 40.96,20.64 v44.13,17.46
PBT_B  (via drill 0.3)
  Top 0.305: SW2.B' SW2.B 53.4,8.51 51.75,10.16 51.75,13.02 51.12,13.65 49.21,13.65 v46.04,16.83
  Bottom 0.305: U2.8 41.93,38.08 44.77,35.24 46.04,35.24 46.25,35.03 R4.2 46.25,31.65 45.09,30.48 43.81,30.48 41.59,28.26 41.59,21.27 v46.04,16.83
PBT_CENT  (via drill 0.3)
  Top 0.254: S1.CTR 8.89,9.61 v8.89,12.7
  Bottom 0.305: v8.89,12.7 8.89,29.21 20.3,40.62 U2.33
PBT_DOWN  (via drill 0.3)
  Top 0.254: v7.62,12.7 7.62,6.99 9.21,5.4 12.38,5.4 13.34,4.45 13.34,3.19 S1.D
  Bottom 0.305: v7.62,12.7 7.62,33.66 19.68,45.72 22.9,45.72 U2.37
PBT_LEFT  (via drill 0.3)
  Top 0.254: S1.C 8.26,8.27 v8.26,13.65
  Bottom 0.305: v8.26,13.65 8.26,33.34 19.37,44.45 22.9,44.45 U2.36
PBT_RIGHT  (via drill 0.3)
  Top 0.254: v10.16,12.7 13.34,9.53 13.34,6.03 14.29,5.08 15.4,5.08 S1.B
  Bottom 0.305: v10.16,12.7 10.16,26.04 20.95,36.83 22.92,36.83 U2.30
PBT_S  (via drill 0.3)
  Top 0.254: v42.55,39.37 43.18,40.01 43.18,41.27 48.58,46.67 v57.15,46.67
  Bottom 0.254: U2.7 42.52,39.35 v42.55,39.37
  Bottom 0.305: v57.15,46.67 59.05,46.67 61.17,48.79 R16.1 61.17,50.7 61.85,51.38 SW3.1
  Bottom 0.406: SW3.3 SW3.1
PBT_UP  (via drill 0.3)
  Top 0.254: S1.A 9.53,10.96 v9.53,13.65
  Bottom 0.305: v9.53,13.65 9.53,26.35 21.25,38.08 U2.31
RESET
  Bottom 0.305: Q2.3 51.77,33.99 53.04,35.26 53.04,36.18 52.39,36.83 49.53,36.83 48.58,37.78 48.58,40.96 47.31,42.23 46.77,42.23 C2.1 46.57,42.23 44.87,42.23 R8.1 42.67,44.43 U2.3
RTS
  Bottom 0.305: U4.2 44.13,28.89 44.45,29.21 50.16,29.21 51.77,30.81 51.77,30.9 | Q2.4 51.77,30.9 | R18.1 51.77,30.9
RXD  (via drill 0.3)
  Top 0.305: v42.55,23.81 25.72,23.81 19.37,30.16 v19.37,41.91
  Bottom 0.305: U4.20 43.5,22.86 v42.55,23.81 | v19.37,41.91 22.9,41.91 U2.34
SCL  (via drill 0.3)
  Top 0.305: v39.37,38.1 42.55,38.1 43.81,39.37 43.81,40.96 48.77,45.91 56.82,45.91 v57.14,45.59
  Bottom 0.305: U$2.23 v57.14,45.59 57.91,45.59 58.42,45.09 58.42,42.23 57.78,41.59 R12.2 | U2.10 40.9,35.56 40.01,35.56 39.69,35.88 39.69,37.78 v39.37,38.1
SDA  (via drill 0.3)
  Top 0.305: 56.83,44.77 v57.15,44.45 56.52,45.09 48.9,45.09 44.77,40.96 44.77,39.37 42.55,37.15 v38.73,37.15
  Bottom 0.305: U$2.24 56.51,45.09 v57.15,44.45 57.15,43.28 R15.2 | v38.73,37.15 38.73,35.24 39.69,34.29 40.9,34.29 U2.11
SHARP_CS
  Bottom 0.305: K1.3 33.25,20.09 27.48,25.86 U2.23
SHARP_EXTMODE
  Bottom 0.305: K1.8 30.75,19.73 21.27,29.21 21.27,31.11 21.89,31.73 U2.26
SHARP_MOSI
  Bottom 0.305: U2.16 36.37,27.79 33.75,25.18 K1.2
SHARP_SCK
  Bottom 0.305: K1.1 34.25,22.5 39.05,27.3 39.05,31.11 39.69,31.75 40.9,31.75 U2.13
SHARP_VCOM
  Bottom 0.305: U2.24 26.2,25.86 32.75,19.32 K1.4
TXD  (via drill 0.3)
  Top 0.305: v45.72,24.77 26.04,24.77 20.32,30.48 v20.32,43.18
  Bottom 0.305: U4.4 45.4,25.08 v45.72,24.77 | v20.32,43.18 22.9,43.18 U2.35
V_BATT
  Bottom 0.508: C6.1 52,15.21 U1.3 53.02,16.2 53.34,16.51 55.88,16.51 57.15,17.78 59.69,17.78 60.33,17.14 60.33,16.2 JP2.2 60.9,16.14 63.18,18.41 63.18,28.26 60.33,31.11 60.33,34.92 59.47,35.78 59.47,38.2 S2.1 S2.2
V_USB  (via drill 0.5)
  Top 0.508: v46.35,22.23 46.99,22.23 v48.26,23.5
  Bottom 0.305: v46.35,22.23 46.67,21.91 U4.15 46.67,19.58 C14.1 | 54.42,28.89 F1.2
  Bottom 0.406: 53.02,17.46 U1.4 50.73,17.81 C19.1 C15.1 48.68,17.78 47.62,17.78 47.2,18.2 C14.1
  Bottom 0.508: v48.26,23.5 50.16,25.4 50.16,27.94 51.12,28.89 54.42,28.89 | F1.2 54.61,29.53 55.88,30.8 55.88,31.65 R7.2 55.98,32.17 57.15,33.34 D3.A 58.1,33.77 Q1.1
VUSB-RAW  (via drill 0.5)
  Top 0.508: v54.93,27.3 54.93,19.68 v55.56,19.05
  Bottom 0.406: J2.VBUS2 55.65,21.05 55.24,20.64 55.24,19.37 v55.56,19.05 | v54.93,27.3 54.93,26.22 F1.1
  Bottom 0.508: C11.1 52.62,25.91 F1.1 54.65,25.95 J2.VBUS1
(copper drawn outside any net)
  shapes: Bottom area x136

### Text on the board
tNames: github.com/CoretechR/ESP32-Handheld
bNames: 3.7V LiPo | REV2 / Maximilian Kern / 02/2020